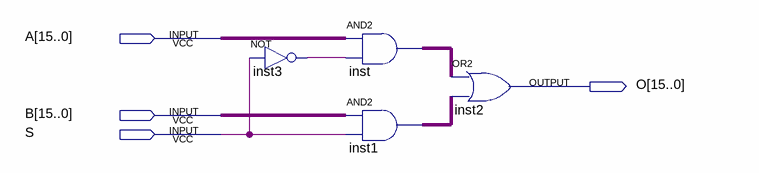
[diagram p0: schematic sheet]
// Quartus schematic 16MUX21.bdf as structural Verilog: 4 symbols, 4 pins
module \16MUX21  (
  input  [15:0] A,
  input  [15:0] B,
  input  S,
  output [15:0] O
);

  wire inst3_out;
  wire [15:0] inst1_out, inst_out;

  not inst3 (inst3_out, S);
  assign inst_out = A & {16{inst3_out}};  // AND2 inst, 16 bits wide
  assign inst1_out = B & {16{S}};  // AND2 inst1, 16 bits wide
  assign O = inst_out | inst1_out;  // OR2 inst2, 16 bits wide
endmodule
